# EAGLE design PROJETO+FINAL+TÉCNICAS+DE+PROTOTIPAGEM (EAGLE 9.7.0)
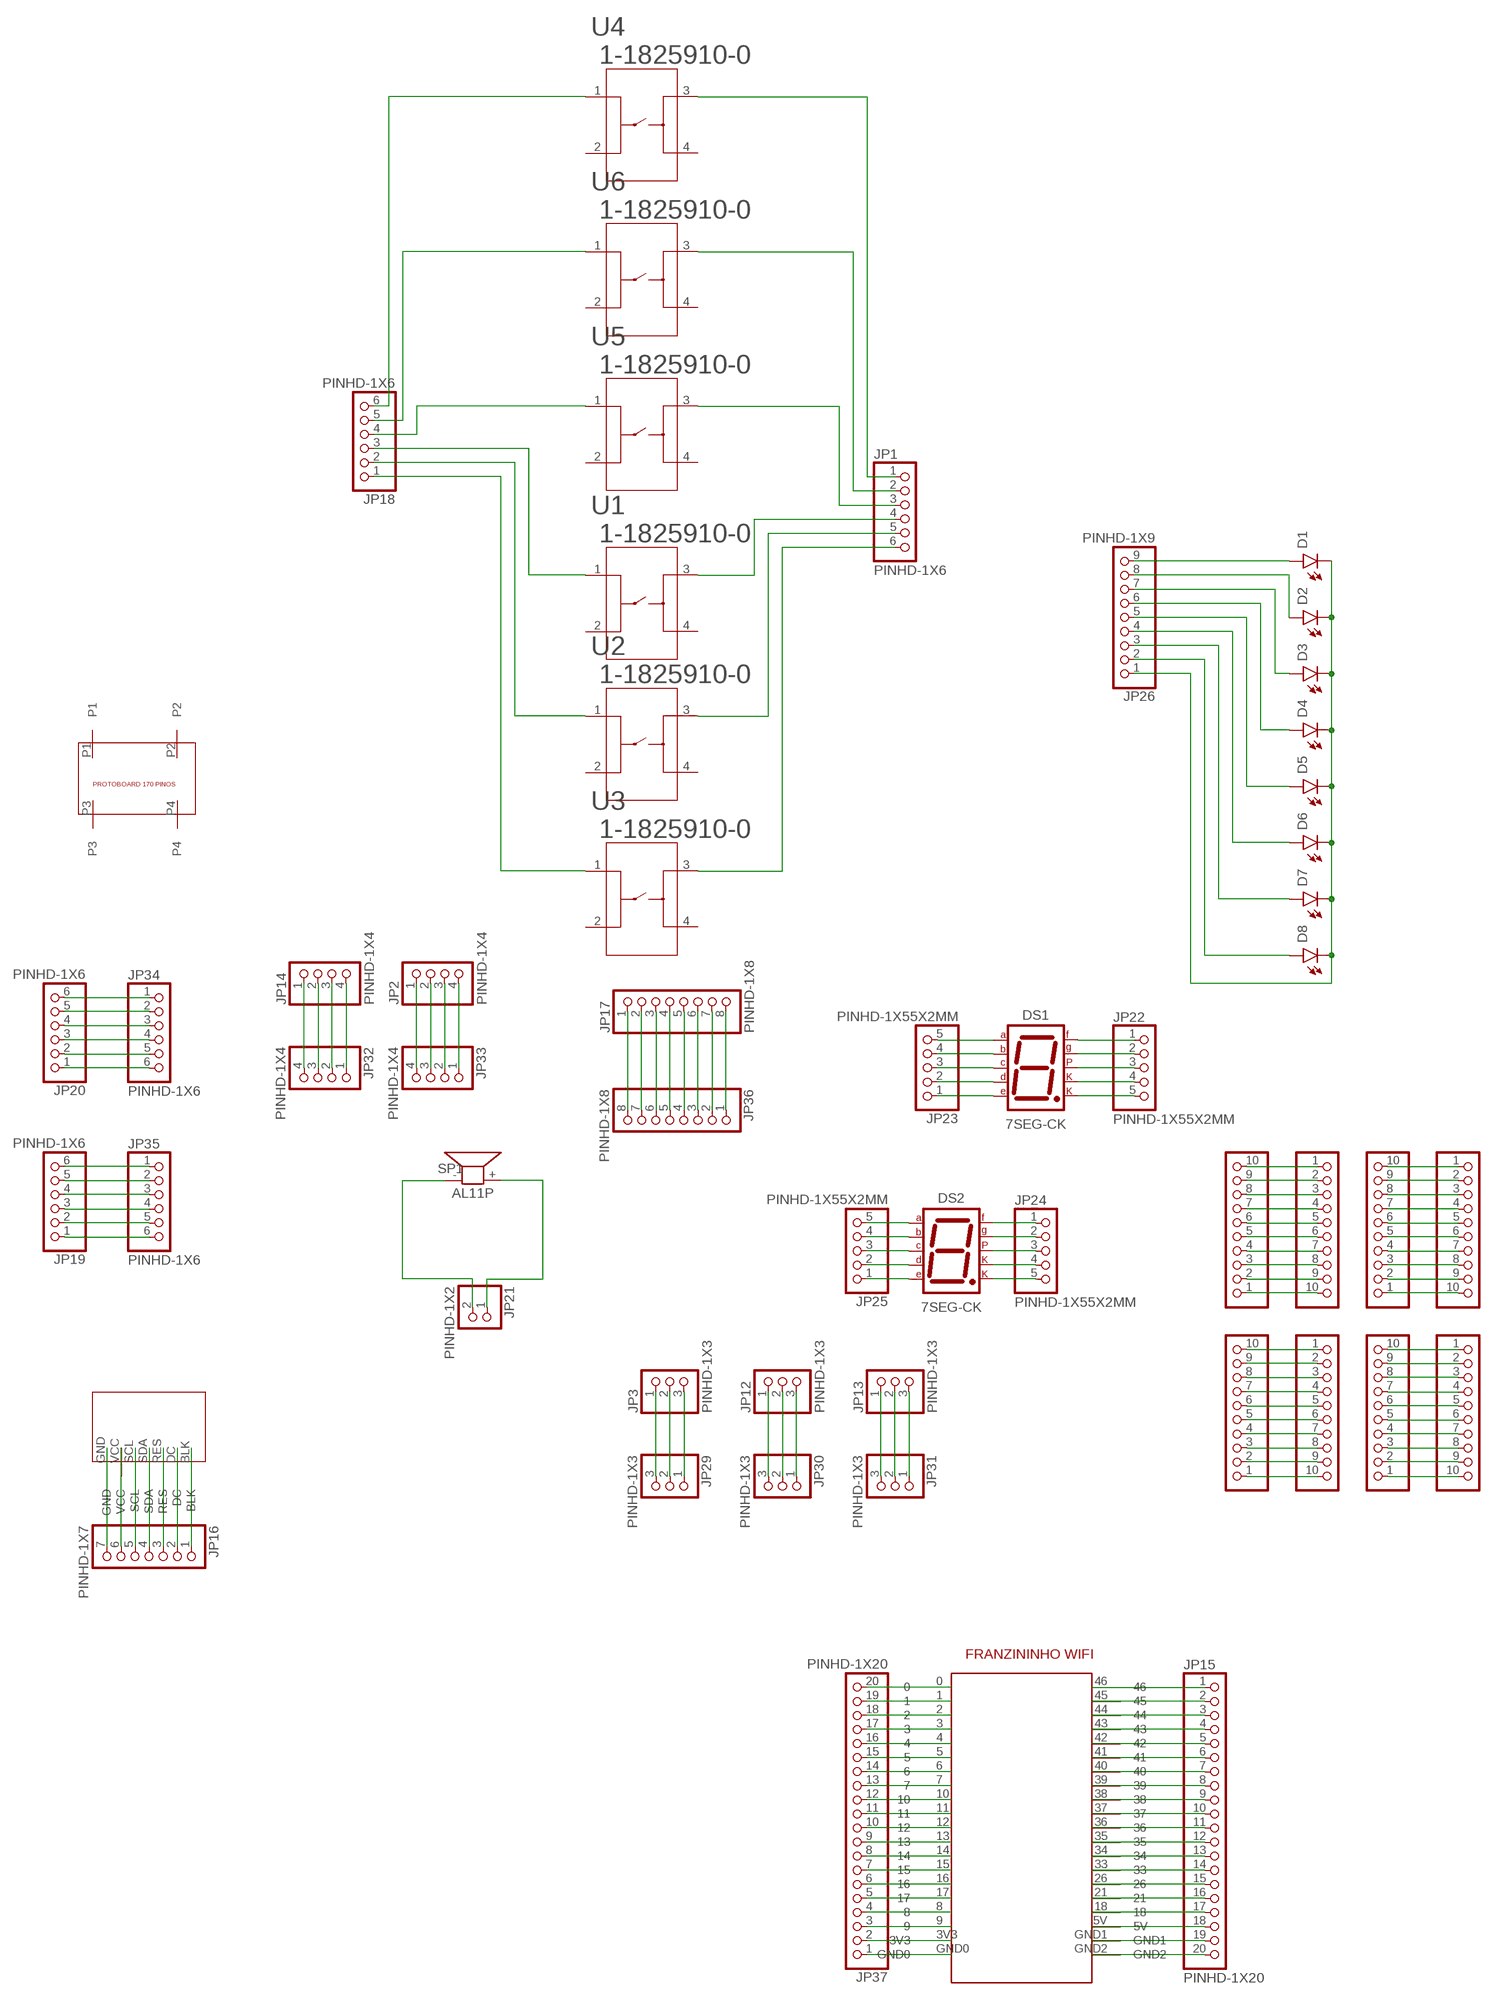
[diagram p0: schematic, sheet 1]

## Parts
D1  LED_RADIAL  [LEDRD254W60D565H860B_W_V1]
D2  LED_RADIAL  [LEDRD254W60D565H860B_W_V1]
D3  LED_RADIAL  [LEDRD254W60D565H860B_W_V1]
D4  LED_RADIAL  [LEDRD254W60D565H860B_W_V1]
D5  LED_RADIAL  [LEDRD254W60D565H860B_W_V1]
D6  LED_RADIAL  [LEDRD254W60D565H860B_W_V1]
D7  LED_RADIAL  [LEDRD254W60D565H860B_W_V1]
D8  LED_RADIAL  [LEDRD254W60D565H860B_W_V1]
DS1  7SEG-CK  [7SEG-13]
DS2  7SEG-CK  [7SEG-13]
JP1  PINHD-1X6  [1X06]
JP2  PINHD-1X4  [1X04]
JP3  PINHD-1X3  [1X03]
JP4  PINHD-1X10  [1X10]
JP5  PINHD-1X10  [1X10]
JP6  PINHD-1X10  [1X10]
JP7  PINHD-1X10  [1X10]
JP8  PINHD-1X10  [1X10]
JP9  PINHD-1X10  [1X10]
JP10  PINHD-1X10  [1X10]
JP11  PINHD-1X10  [1X10]
JP12  PINHD-1X3  [1X03]
JP13  PINHD-1X3  [1X03]
JP14  PINHD-1X4  [1X04]
JP15  PINHD-1X20  [1X20]
JP16  PINHD-1X7  [1X07]
JP17  PINHD-1X8  [1X08]
JP18  PINHD-1X6  [1X06]
JP19  PINHD-1X6  [1X06]
JP20  PINHD-1X6  [1X06]
JP21  PINHD-1X2  [1X02]
JP22  PINHD-1X55X2MM  [1_05X2MM]
JP23  PINHD-1X55X2MM  [1_05X2MM]
JP24  PINHD-1X55X2MM  [1_05X2MM]
JP25  PINHD-1X55X2MM  [1_05X2MM]
JP26  PINHD-1X9  [1X09]
JP29  PINHD-1X3  [1X03]
JP30  PINHD-1X3  [1X03]
JP31  PINHD-1X3  [1X03]
JP32  PINHD-1X4  [1X04]
JP33  PINHD-1X4  [1X04]
JP34  PINHD-1X6  [1X06]
JP35  PINHD-1X6  [1X06]
JP36  PINHD-1X8  [1X08]
JP37  PINHD-1X20  [1X20]
SP1  AL11P  [AL11P]
U1  1-1825910-0  [SWITCH_1-1825910-0]
U2  1-1825910-0  [SWITCH_1-1825910-0]
U3  1-1825910-0  [SWITCH_1-1825910-0]
U4  1-1825910-0  [SWITCH_1-1825910-0]
U5  1-1825910-0  [SWITCH_1-1825910-0]
U6  1-1825910-0  [SWITCH_1-1825910-0]
U$1  FRANZINO_WIFI  [FRANZININHO_WIFI]
U$2  DISPLAY_TFT_SPI  [PERIMETRO_DISPLAY_TFT]
U$3  PROTOBOARD_170_PINOS  [PROTOBOARD_170_PINOS]

## Nets
N$1: D1.1(A) JP26.9
N$2: D2.1(A) JP26.8
N$3: D3.1(A) JP26.7
N$4: D4.1(A) JP26.6
N$5: D5.1(A) JP26.5
N$6: D6.1(A) JP26.4
N$7: D7.1(A) JP26.3
N$8: D8.1(A) JP26.2
N$9: D1.2(C) D2.2(C) D3.2(C) D4.2(C) D5.2(C) D6.2(C) D7.2(C) D8.2(C) JP26.1
N$10: JP8.2 JP8.6 JP10.5 JP10.9
N$11: JP7.2 JP7.6 JP9.5 JP9.9
N$12: JP4.2 JP4.6 JP6.5 JP6.9
N$13: JP5.2 JP5.6 JP11.5 JP11.9
N$14: JP7.1 JP9.10
N$15: JP7.3 JP9.8
N$16: JP7.4 JP9.7
N$17: JP7.5 JP9.6
N$18: JP1.1 U4.3
N$19: JP1.2 U6.3
N$20: JP1.3 U5.3
N$21: JP1.4 U1.3
N$22: JP1.5 U2.3
N$23: JP1.6 U3.3
N$24: JP18.6 U4.1
N$25: JP18.5 U6.1
N$26: JP18.4 U5.1
N$27: JP18.3 U1.1
N$28: JP18.2 U2.1
N$29: JP18.1 U3.1
N$30: DS1.9(F) JP22.1
N$31: DS1.10(G) JP22.2
N$32: DS1.5(DP) JP22.3
N$33: DS1.3(CK1) JP22.4
N$34: DS1.8(CK2) JP22.5
N$35: DS1.7(A) JP23.5
N$36: DS1.6(B) JP23.4
N$37: DS1.4(C) JP23.3
N$38: DS1.2(D) JP23.2
N$39: DS1.1(E) JP23.1
N$40: DS2.9(F) JP24.1
N$41: DS2.10(G) JP24.2
N$42: DS2.5(DP) JP24.3
N$43: DS2.3(CK1) JP24.4
N$44: DS2.8(CK2) JP24.5
N$45: DS2.7(A) JP25.5
N$46: DS2.6(B) JP25.4
N$47: DS2.4(C) JP25.3
N$48: DS2.2(D) JP25.2
N$49: DS2.1(E) JP25.1
N$50: JP21.1 SP1.+
N$51: JP21.2 SP1.-
N$52: JP15.11 JP37.16 U$1.4 U$1.36
N$53: JP15.9 JP37.4 U$1.8 U$1.38
N$54: JP37.20 U$1.0
N$55: JP37.19 U$1.1
N$56: JP37.18 U$1.2
N$57: JP37.17 U$1.3
N$58: JP37.15 U$1.5
N$59: JP37.14 U$1.6
N$60: JP37.13 U$1.7
N$61: JP37.12 U$1.10
N$62: JP37.11 U$1.11
N$63: JP37.10 U$1.12
N$64: JP37.9 U$1.13
N$65: JP37.8 U$1.14
N$66: JP37.7 U$1.15
N$67: JP37.6 U$1.16
N$68: JP37.5 U$1.17
N$69: JP37.3 U$1.9
N$70: JP37.2 U$1.3V3
N$71: JP37.1 U$1.GND0
N$72: JP15.1 U$1.46
N$73: JP15.2 U$1.45
N$74: JP15.3 U$1.44
N$75: JP15.4 U$1.43
N$76: JP15.5 U$1.42
N$77: JP15.6 U$1.41
N$78: JP15.7 U$1.40
N$79: JP15.8 U$1.39
N$80: JP15.10 U$1.37
N$81: JP15.12 U$1.35
N$82: JP15.13 U$1.34
N$83: JP15.14 U$1.33
N$84: JP15.15 U$1.26
N$85: JP15.16 U$1.21
N$86: JP15.17 U$1.18
N$87: JP15.18 U$1.5V
N$88: JP15.19 U$1.GND1
N$89: JP15.20 U$1.GND2
N$90: JP3.1 JP29.3
N$91: JP3.2 JP29.2
N$92: JP3.3 JP29.1
N$93: JP12.1 JP30.3
N$94: JP12.2 JP30.2
N$95: JP12.3 JP30.1
N$96: JP13.1 JP31.3
N$97: JP13.2 JP31.2
N$98: JP13.3 JP31.1
N$99: JP14.1 JP32.4
N$100: JP14.2 JP32.3
N$101: JP14.3 JP32.2
N$102: JP14.4 JP32.1
N$103: JP2.1 JP33.4
N$104: JP2.2 JP33.3
N$105: JP2.3 JP33.2
N$106: JP2.4 JP33.1
N$107: JP20.6 JP34.1
N$108: JP20.5 JP34.2
N$109: JP20.4 JP34.3
N$110: JP20.3 JP34.4
N$111: JP20.2 JP34.5
N$112: JP20.1 JP34.6
N$113: JP19.6 JP35.1
N$114: JP19.5 JP35.2
N$115: JP19.4 JP35.3
N$116: JP19.3 JP35.4
N$117: JP19.2 JP35.5
N$118: JP19.1 JP35.6
N$119: JP17.1 JP36.8
N$120: JP17.2 JP36.7
N$121: JP17.3 JP36.6
N$122: JP17.4 JP36.5
N$123: JP17.5 JP36.4
N$124: JP17.6 JP36.3
N$125: JP17.7 JP36.2
N$126: JP17.8 JP36.1
N$127: JP7.7 JP9.4
N$128: JP7.8 JP9.3
N$129: JP7.9 JP9.2
N$130: JP7.10 JP9.1
N$131: JP8.1 JP10.10
N$132: JP8.3 JP10.8
N$133: JP8.4 JP10.7
N$134: JP8.5 JP10.6
N$135: JP8.7 JP10.4
N$136: JP8.8 JP10.3
N$137: JP8.9 JP10.2
N$138: JP8.10 JP10.1
N$139: JP4.1 JP6.10
N$140: JP4.3 JP6.8
N$141: JP4.4 JP6.7
N$142: JP4.5 JP6.6
N$143: JP4.7 JP6.4
N$144: JP4.8 JP6.3
N$145: JP4.9 JP6.2
N$146: JP4.10 JP6.1
N$147: JP5.1 JP11.10
N$148: JP5.3 JP11.8
N$149: JP5.4 JP11.7
N$150: JP5.5 JP11.6
N$151: JP5.7 JP11.4
N$152: JP5.8 JP11.3
N$153: JP5.9 JP11.2
N$154: JP5.10 JP11.1
N$155: JP16.7 U$2.GND
N$156: JP16.6 U$2.VCC
N$157: JP16.5 U$2.SCL
N$158: JP16.4 U$2.SDA
N$159: JP16.3 U$2.RES
N$160: JP16.2 U$2.DC
N$161: JP16.1 U$2.BLK
Unconnected: U1.2 U1.4 U2.2 U2.4 U3.2 U3.4 U4.2 U4.4 U5.2 U5.4 U6.2 U6.4 U$3.P1 U$3.P2 U$3.P3 U$3.P4

## Library data of the parts
D1-D8 = Lib_Opto_Eletronic_Led_Verde:LED_RADIAL: LED - Generic
DS1 DS2 = Opto-Electronic:7SEG-CK: 7-segment DISPLAY single cathode, 13 mm; CATEGORY: Opto-Electronic; SUB-CATEGORY: Display; TYPE: 7-Segment
JP1 JP18-JP20 JP34 JP35 = Connector:PINHD-1X6: PIN HEADER; CATEGORY: CONNECTOR; SUB-CATEGORY: PIN-HEADER
JP2 JP14 JP32 JP33 = Connector:PINHD-1X4: PIN HEADER; CATEGORY: CONNECTOR; SUB-CATEGORY: PIN-HEADER
JP3 JP12 JP13 JP29-JP31 = Connector:PINHD-1X3: PIN HEADER; CATEGORY: CONNECTOR; SUB-CATEGORY: PIN-HEADER
JP4-JP11 = Connector:PINHD-1X10: PIN HEADER; CATEGORY: CONNECTOR; SUB-CATEGORY: PIN-HEADER
JP15 JP37 = Connector:PINHD-1X20: PIN HEADER; CATEGORY: CONNECTOR; SUB-CATEGORY: PIN-HEADER
JP16 = Connector:PINHD-1X7: PIN HEADER; CATEGORY: CONNECTOR; SUB-CATEGORY: PIN-HEADER
JP17 JP36 = Connector:PINHD-1X8: PIN HEADER; CATEGORY: CONNECTOR; SUB-CATEGORY: PIN-HEADER
JP21 = Connector:PINHD-1X2: PIN HEADER; CATEGORY: CONNECTOR; SUB-CATEGORY: PIN-HEADER
JP22-JP25 = Connector:PINHD-1X5: PIN HEADER; CATEGORY: CONNECTOR; SUB-CATEGORY: PIN-HEADER
JP26 = Connector:PINHD-1X9: PIN HEADER; CATEGORY: CONNECTOR; SUB-CATEGORY: PIN-HEADER
SP1 = buzzer:AL11P: SPEAKER Source: Buerklin; OC_FARNELL: unknown; OC_NEWARK: unknown
U1-U6 = Switches:1-1825910-0; BUILT_BY: EMA_UL_Team; CATEGORY: Tactile Switches; COPYRIGHT: Copyright (C) 2016 Accelerated Designs. All rights reserved; DESCRIPTION: FSM6JH=6MM TACT SWITCH, HIGH TEMP; MANUFACTURER_PART_NUMBER: 1-1825910-0; PART_STATUS: active; SERIES: Unknown; VENDOR: TE Connectivity
U$1 = biblioteca franzininho wifi:FRANZINO_WIFI
U$2 = biblioteca display tft:DISPLAY_TFT_SPI
U$3 = biblioteca protoboard 170 pinos:PROTOBOARD_170_PINOS

## Board
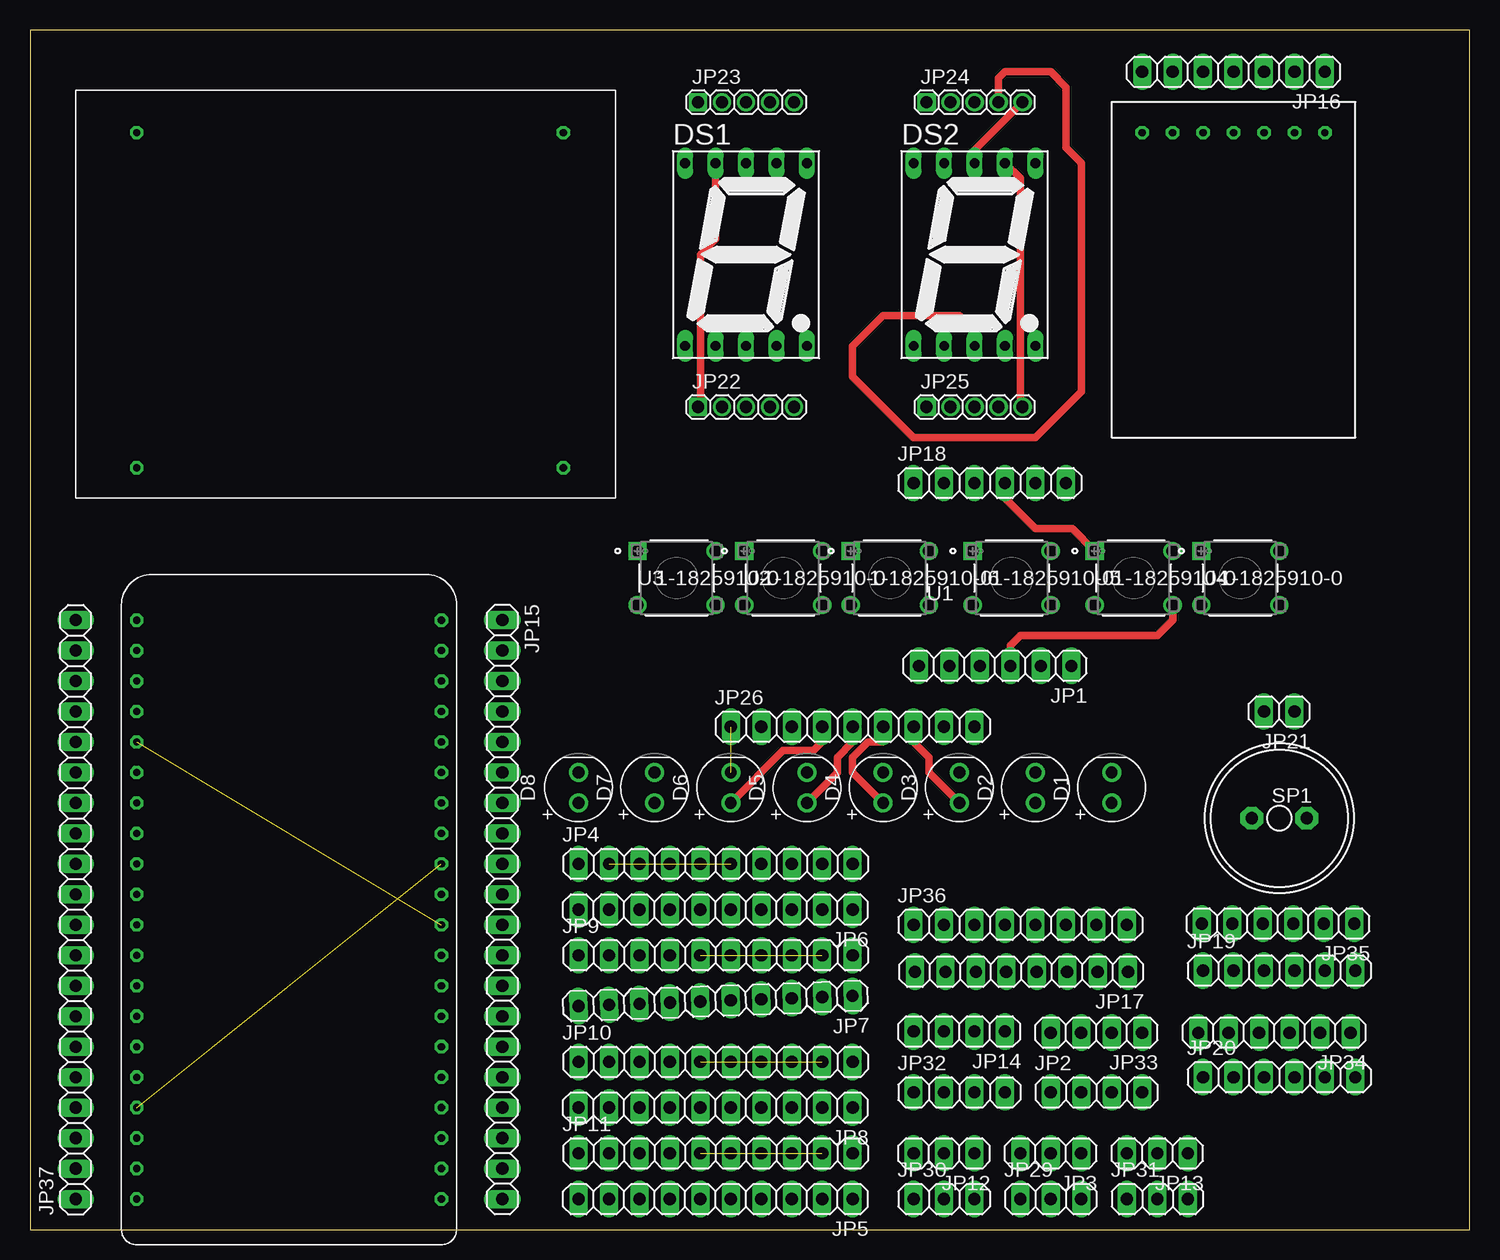
[diagram p1: board, top side]
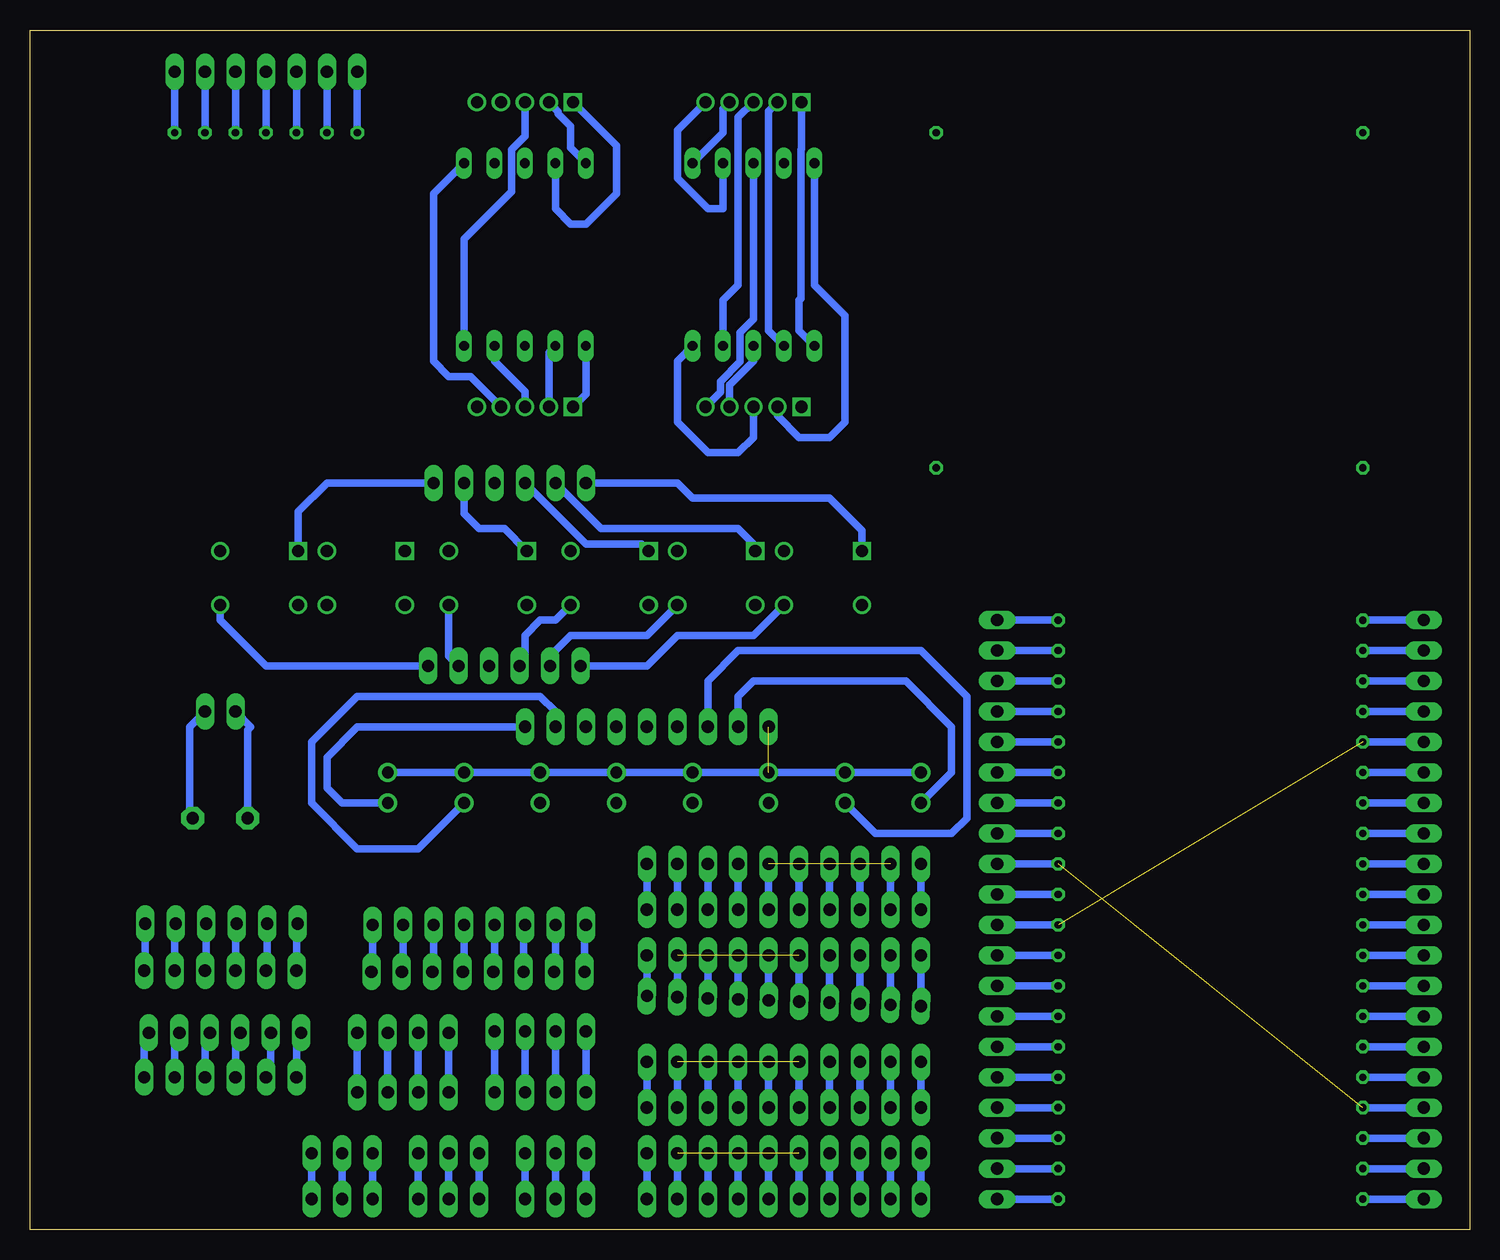
[diagram p2: board, bottom side, seen from below]

Size 120 x 100 mm. Coordinates in mm from the lower left corner, seen from the top.
Outline: 0,0 120,0 120,100 0,100 0,0
Copper layers (1*16): Top / Bottom
Stack-up Default Layer Stack: Top User Defined 0.035mm / Dielectric-1 User Defined 1.5mm / Bottom User Defined 0.035mm
Design rules "default": minimum track width 6mil, minimum drill 0.35mm, track to track 6mil, track to pad 6mil, pad to pad 6mil, via to via 6mil, smd to smd 6mil, copper to edge 40mil, drill to drill 6mil, minimum pad ring 10mil, minimum via ring 8mil, stop-mask expansion 4mil, vias tented up to drill 0mil, thermal gap 10mil

### Footprints (pad centres in the part's own frame; a part is rotated, then mirrored left to right if it is on the bottom)
LEDRD254W60D565H860B_W_V1 = drill 0.981 pad 1.581: 1 -1.27,0; 2 1.27,0
7SEG-13 = drill 0.813 long: 1 -5.08,-7.62; 2 -2.54,-7.62; 3 0,-7.62; 4 2.54,-7.62; 5 5.08,-7.62; 6 5.08,7.62; 7 2.54,7.62; 8 0,7.62; 9 -2.54,7.62; 10 -5.08,7.62
1X06 = drill 1.016 long: 1 -6.35,0; 2 -3.81,0; 3 -1.27,0; 4 1.27,0; 5 3.81,0; 6 6.35,0
1X04 = drill 1.016 long: 1 -3.81,0; 2 -1.27,0; 3 1.27,0; 4 3.81,0
1X03 = drill 1.016 long: 1 -2.54,0; 2 0,0; 3 2.54,0
1X10 = drill 1.016 long: 1 -11.43,0; 2 -8.89,0; 3 -6.35,0; 4 -3.81,0; 5 -1.27,0; 6 1.27,0; 7 3.81,0; 8 6.35,0; 9 8.89,0; 10 11.43,0
1X20 = drill 1.016 long: 1 -24.13,0; 2 -21.59,0; 3 -19.05,0; 4 -16.51,0; 5 -13.97,0; 6 -11.43,0; 7 -8.89,0; 8 -6.35,0; 9 -3.81,0; 10 -1.27,0; 11 1.27,0; 12 3.81,0; 13 6.35,0; 14 8.89,0; 15 11.43,0; 16 13.97,0; 17 16.51,0; 18 19.05,0; 19 21.59,0; 20 24.13,0
1X07 = drill 1.016 long: 1 -7.62,0; 2 -5.08,0; 3 -2.54,0; 4 0,0; 5 2.54,0; 6 5.08,0; 7 7.62,0
1X08 = drill 1.016 long: 1 -8.89,0; 2 -6.35,0; 3 -3.81,0; 4 -1.27,0; 5 1.27,0; 6 3.81,0; 7 6.35,0; 8 8.89,0
1X02 = drill 1.016 long: 1 -1.27,0; 2 1.27,0
1_05X2MM = drill 1.016 pad 1.3 square: 1 -4,0 | drill 1.016 pad 1.3: 2 -2,0; 3 0,0; 4 2,0; 5 4,0
1X09 = drill 1.016 long: 1 -10.16,0; 2 -7.62,0; 3 -5.08,0; 4 -2.54,0; 5 0,0; 6 2.54,0; 7 5.08,0; 8 7.62,0; 9 10.16,0
AL11P = drill 1.016 pad 1.905 octagon: + 2.286,0; - -2.286,0
SWITCH_1-1825910-0 = drill 1.016 pad 1.524 square: 1 -6.502,4.496 | drill 1.016 pad 1.524: 2 -6.502,0; 3 0,0; 4 0,4.496
FRANZININHO_WIFI = drill 0.6 octagon: 0 0,48.26; 1 0,45.72; 2 0,43.18; 3 0,40.64; 3V3 0,2.54; 4 0,38.1; 5 0,35.56; 5V 25.4,5.08; 6 0,33.02; 7 0,30.48; 8 0,7.62; 9 0,5.08; 10 0,27.94; 11 0,25.4; 12 0,22.86; 13 0,20.32; 14 0,17.78; 15 0,15.24; 16 0,12.7; 17 0,10.16; 18 25.4,7.62; 21 25.4,10.16; 26 25.4,12.7; 33 25.4,15.24; 34 25.4,17.78; 35 25.4,20.32; 36 25.4,22.86; 37 25.4,25.4; 38 25.4,27.94; 39 25.4,30.48; 40 25.4,33.02; 41 25.4,35.56; 42 25.4,38.1; 43 25.4,40.64; 44 25.4,43.18; 45 25.4,45.72; 46 25.4,48.26; GND0 0,0; GND1 25.4,2.54; GND2 25.4,0
PERIMETRO_DISPLAY_TFT = drill 0.6 octagon: BLK 15.24,0; DC 12.7,0; GND 0,0; RES 10.16,0; SCL 5.08,0; SDA 7.62,0; VCC 2.54,0
PROTOBOARD_170_PINOS = drill 0.6 octagon: P1 5.08,30.48; P2 5.08,2.54; P3 40.64,30.48; P4 40.64,2.54

### Placement (x,y rotation side)
D1  90.17,36.83 90 top
D2  83.82,36.83 90 top
D3  77.47,36.83 90 top
D4  71.12,36.83 90 top
D5  64.77,36.83 90 top
D6  58.42,36.83 90 top
D7  52.07,36.83 90 top
D8  45.72,36.83 90 top
DS1  59.69,81.28 0 top
DS2  78.74,81.28 0 top
JP1  80.45,46.99 180 top
JP2  88.9,11.43 0 top
JP3  85.09,6.35 180 top
JP4  57.15,30.48 0 top
JP5  57.15,2.54 180 top
JP6  57.15,26.67 180 top
JP7  57.15,19.05 182.1 top
JP8  57.15,10.16 180 top
JP9  57.15,22.86 0 top
JP10  57.15,13.97 0 top
JP11  57.15,6.35 0 top
JP12  76.2,6.35 180 top
JP13  93.98,6.35 180 top
JP14  77.47,16.51 180 top
JP15  39.37,26.67 270 top
JP16  100.33,96.52 180 top
JP17  82.65,21.49 180 top
JP18  80.01,62.23 0 top
JP19  104.14,21.59 0 top
JP20  104.14,12.7 0 top
JP21  104.14,43.18 180 top
JP22  59.69,68.58 0 top
JP23  59.69,93.98 0 top
JP24  78.74,93.98 0 top
JP25  78.74,68.58 0 top
JP26  68.58,41.91 0 top
JP29  85.09,2.54 0 top
JP30  76.2,2.54 0 top
JP31  93.98,2.54 0 top
JP32  77.47,11.43 0 top
JP33  88.9,16.41 180 top
JP34  103.73,16.41 180 top
JP35  104.04,25.5 180 top
JP36  82.55,25.4 0 top
JP37  3.81,26.67 90 top
SP1  104.14,34.29 0 top
U1  74.93,52.07 0 top
U2  66.04,52.07 0 top
U3  57.15,52.07 0 top
U4  104.14,52.07 0 top
U5  95.25,52.07 0 top
U6  85.09,52.07 0 top
U$1  8.89,2.54 0 top
U$2  92.71,91.44 0 top
U$3  3.81,60.96 0 top

### Tracks (layer width: path | path; a pad name or v marks a point on that pad's centre or on a via)
N$1
  Bottom 0.61: D1.1 93.98,35.56 95.25,36.83 95.25,39.37 92.71,41.91 JP26.9
N$2
  Bottom 0.61: D2.1 87.63,31.75 92.71,31.75 96.52,35.56 96.52,40.64 92.71,44.45 77.47,44.45 76.2,43.18 JP26.8
N$3
  Top 0.61: D3.1 74.93,38.1 74.93,39.37 73.66,40.64 JP26.7
N$4
  Top 0.61: D4.1 68.58,38.1 68.58,39.37 69.85,40.64 71.12,40.64 JP26.6
N$5
  Top 0.61: D5.1 67.31,38.1 67.31,39.37 68.58,40.64 JP26.5
N$6
  Top 0.61: D6.1 62.79,39.93 65.33,39.93 66.04,40.64 JP26.4
N$7
  Bottom 0.61: D7.1 49.53,33.02 43.18,33.02 41.91,34.29 41.91,44.45 45.72,48.26 60.96,48.26 63.5,45.72 JP26.3
N$8
  Bottom 0.61: D8.1 43.18,38.1 43.18,41.91 46.99,45.72 59.69,45.72 60.96,44.45 JP26.2
N$9  (1 unrouted)
  Bottom 0.61: D8.2 D7.2 D6.2 D5.2 D4.2 D3.2 | 78.74,38.1 D3.2 | D3.2 D2.2 D1.2
N$10  (1 unrouted)
  Bottom 0.61: JP10.5 JP8.6 | JP8.2 JP10.9
N$11  (1 unrouted)
  Bottom 0.61: JP9.5 JP7.6 | JP9.9 JP7.2
N$12  (1 unrouted)
  Bottom 0.61: JP6.9 JP4.2 | JP6.5 JP4.6
N$13  (1 unrouted)
  Bottom 0.61: JP5.6 JP11.5 | JP5.2 JP11.9
N$14
  Bottom 0.61: JP7.1 JP9.10
N$15
  Bottom 0.61: JP7.3 JP9.8
N$16
  Bottom 0.61: JP9.7 JP7.4
N$17
  Bottom 0.61: JP7.5 JP9.6
N$18
  Bottom 0.61: JP1.1 100.33,46.99 104.14,50.8 U4.3
N$19
  Bottom 0.61: JP1.2 85.09,47.82 U6.3
N$20
  Top 0.61: JP1.3 81.72,48.7 82.55,49.53 93.98,49.53 95.25,50.8 U5.3
N$21
  Bottom 0.61: JP1.4 78.74,47.43 78.74,49.53 77.47,50.8 76.2,50.8 U1.3
N$22
  Bottom 0.61: JP1.5 76.64,47.82 74.93,49.53 68.58,49.53 U2.3
N$23
  Bottom 0.61: U3.3 59.69,49.53 66.04,49.53 68.58,46.99 JP1.6
N$24
  Bottom 0.61: JP18.6 95.25,62.23 97.64,59.84 U4.1
N$25
  Bottom 0.61: U6.1 80.44,58.42 82.55,58.42 83.82,59.69 JP18.5
N$26
  Top 0.61: U5.1 86.89,58.42 83.82,58.42 81.28,60.96 JP18.4
N$27
  Bottom 0.61: JP18.3 73.66,57.15 69.01,57.15 U1.1
N$28
  Bottom 0.61: JP18.2 72.39,58.42 60.96,58.42 59.54,57 U2.1
N$29
  Bottom 0.61: U3.1 50.65,58.27 53.34,60.96 64.77,60.96 66.04,62.23 JP18.1
N$30
  Top 0.61: JP22.1 55.88,68.77 55.88,81.28 57.15,82.55 DS1.9
N$31
  Bottom 0.61: DS1.10 54.61,78.74 52.07,76.2 52.07,67.31 53.34,66.04 55.88,66.04 57.69,67.85 JP22.2
N$32
  Bottom 0.61: JP22.3 59.69,66.04 60.96,64.77 63.5,64.77 66.04,67.31 66.04,72.39 DS1.5
N$33
  Bottom 0.61: JP22.4 61.69,70.39 59.69,72.39 DS1.3
N$34
  Bottom 0.61: JP22.5 62.45,69.82 62.45,70.71 60.81,72.35 60.81,74.78 59.69,75.9 DS1.8
N$35
  Bottom 0.61: JP23.5 66.04,91.63 66.04,87.63 63.5,85.09 62.23,85.09 DS1.7
N$36
  Bottom 0.61: JP23.4 62.23,93.44 62.23,91.44 DS1.6
N$37
  Bottom 0.61: JP23.3 60.96,92.71 60.96,78.74 62.23,77.47 DS1.4
N$38
  Bottom 0.61: JP23.2 58.42,93.25 58.42,74.93 DS1.2
N$39
  Bottom 0.61: JP23.1 55.69,90.06 55.73,90.02 55.73,77.62 55.88,77.47 55.88,74.93 DS1.1
N$40
  Bottom 0.61: JP24.1 71.12,90.36 71.12,86.36 73.66,83.82 74.93,83.82 76.2,85.09 DS2.9
N$41
  Bottom 0.61: JP24.2 75.96,93.2 75.96,93.03 74.93,92 74.93,90.17 DS2.10
N$42
  Bottom 0.61: JP24.3 78.74,91.14 79.86,90.02 79.86,86.51 83.82,82.55 DS2.5
N$43
  Top 0.61: JP24.4 80.74,95.98 81.28,96.52 85.09,96.52 86.36,95.25 86.36,90.17 87.63,88.9 87.63,69.85 83.82,66.04 73.66,66.04 68.58,71.12 68.58,73.66 71.12,76.2 77.47,76.2 78.74,74.93 DS2.3
N$44
  Top 0.61: JP24.5 78.74,89.98 DS2.8
N$45
  Top 0.61: JP25.5 82.55,68.77 82.55,87.63 DS2.7
N$46
  Bottom 0.61: JP25.4 83.28,71.12 85.09,71.12 86.36,72.39 86.36,86.36 DS2.6
N$47
  Bottom 0.61: JP25.3 78.74,69.85 81.28,72.39 DS2.4
N$48
  Bottom 0.61: JP25.2 76.74,73.12 DS2.2
N$49
  Bottom 0.61: JP25.1 73.66,69.66 DS2.1
N$50
  Bottom 0.61: JP21.1 106.68,41.91 106.68,34.54 SP1.+
N$51
  Bottom 0.61: SP1.- 101.85,41.66 101.6,41.91 JP21.2
N$52  (1 unrouted)
  Bottom 0.61: JP37.16 U$1.4 | JP15.11 U$1.36
N$53  (1 unrouted)
  Bottom 0.61: JP37.4 U$1.8 | JP15.9 U$1.38
N$54
  Bottom 0.61: JP37.20 U$1.0
N$55
  Bottom 0.61: JP37.19 U$1.1
N$56
  Bottom 0.61: JP37.18 U$1.2
N$57
  Bottom 0.61: JP37.17 U$1.3
N$58
  Bottom 0.61: JP37.15 U$1.5
N$59
  Bottom 0.61: JP37.14 U$1.6
N$60
  Bottom 0.61: U$1.7 JP37.13
N$61
  Bottom 0.61: JP37.12 U$1.10
N$62
  Bottom 0.61: U$1.11 JP37.11
N$63
  Bottom 0.61: JP37.10 U$1.12
N$64
  Bottom 0.61: U$1.13 JP37.9
N$65
  Bottom 0.61: JP37.8 U$1.14
N$66
  Bottom 0.61: U$1.15 JP37.7
N$67
  Bottom 0.61: JP37.6 U$1.16
N$68
  Bottom 0.61: JP37.5 U$1.17
N$69
  Bottom 0.61: JP37.3 U$1.9
N$70
  Bottom 0.61: JP37.2 U$1.3V3
N$71
  Bottom 0.61: JP37.1 U$1.GND0
N$72
  Bottom 0.61: U$1.46 JP15.1
N$73
  Bottom 0.61: U$1.45 JP15.2
N$74
  Bottom 0.61: U$1.44 JP15.3
N$75
  Bottom 0.61: U$1.43 JP15.4
N$76
  Bottom 0.61: JP15.5 U$1.42
N$77
  Bottom 0.61: U$1.41 JP15.6
N$78
  Bottom 0.61: JP15.7 U$1.40
N$79
  Bottom 0.61: U$1.39 JP15.8
N$80
  Bottom 0.61: U$1.37 JP15.10
N$81
  Bottom 0.61: U$1.35 JP15.12
N$82
  Bottom 0.61: JP15.13 U$1.34
N$83
  Bottom 0.61: U$1.33 JP15.14
N$84
  Bottom 0.61: JP15.15 U$1.26
N$85
  Bottom 0.61: U$1.21 JP15.16
N$86
  Bottom 0.61: JP15.17 U$1.18
N$87
  Bottom 0.61: U$1.5V JP15.18
N$88
  Bottom 0.61: JP15.19 U$1.GND1
N$89
  Bottom 0.61: U$1.GND2 JP15.20
N$90
  Bottom 0.61: JP29.3 JP3.1
N$91
  Bottom 0.61: JP3.2 JP29.2
N$92
  Bottom 0.61: JP29.1 JP3.3
N$93
  Bottom 0.61: JP12.1 JP30.3
N$94
  Bottom 0.61: JP30.2 JP12.2
N$95
  Bottom 0.61: JP12.3 JP30.1
N$96
  Bottom 0.61: JP13.1 JP31.3
N$97
  Bottom 0.61: JP31.2 JP13.2
N$98
  Bottom 0.61: JP13.3 JP31.1
N$99
  Bottom 0.61: JP32.4 JP14.1
N$100
  Bottom 0.61: JP14.2 JP32.3
N$101
  Bottom 0.61: JP32.2 JP14.3
N$102
  Bottom 0.61: JP14.4 JP32.1
N$103
  Bottom 0.61: JP33.4 JP2.1
N$104
  Bottom 0.61: JP2.2 JP33.3
N$105
  Bottom 0.61: JP33.2 JP2.3
N$106
  Bottom 0.61: JP2.4 JP33.1
N$107
  Bottom 0.61: JP34.1 110.49,16 JP20.6
N$108
  Bottom 0.61: JP34.2 107.95,16 JP20.5
N$109
  Bottom 0.61: JP34.3 105.41,16 JP20.4
N$110
  Bottom 0.61: JP34.4 102.87,16 JP20.3
N$111
  Bottom 0.61: JP20.2 99.92,13.11 JP34.5
N$112
  Bottom 0.61: JP34.6 97.79,16 JP20.1
N$113
  Bottom 0.61: JP19.6 110.39,21.69 JP35.1
N$114
  Bottom 0.61: JP35.2 107.95,25.4 JP19.5
N$115
  Bottom 0.61: JP19.4 105.31,21.69 JP35.3
N$116
  Bottom 0.61: JP35.4 102.87,25.4 JP19.3
N$117
  Bottom 0.61: JP19.2 100.23,21.69 JP35.5
N$118
  Bottom 0.61: JP35.6 97.79,25.4 JP19.1
N$119
  Bottom 0.61: JP17.1 91.44,21.59 JP36.8
N$120
  Bottom 0.61: JP36.7 88.9,21.59 JP17.2
N$121
  Bottom 0.61: JP17.3 86.36,21.59 JP36.6
N$122
  Bottom 0.61: JP36.5 83.82,21.59 JP17.4
N$123
  Bottom 0.61: JP17.5 81.28,21.59 JP36.4
N$124
  Bottom 0.61: JP36.3 78.84,25.3 JP17.6
N$125
  Bottom 0.61: JP17.7 76.2,21.59 JP36.2
N$126
  Bottom 0.61: JP36.1 73.76,25.3 JP17.8
N$127
  Bottom 0.61: JP9.4 JP7.7
N$128
  Bottom 0.61: JP7.8 JP9.3
N$129
  Bottom 0.61: JP9.2 JP7.9
N$130
  Bottom 0.61: JP9.1 JP7.10
N$131
  Bottom 0.61: JP10.10 JP8.1
N$132
  Bottom 0.61: JP10.8 JP8.3
N$133
  Bottom 0.61: JP8.4 JP10.7
N$134
  Bottom 0.61: JP10.6 JP8.5
N$135
  Bottom 0.61: JP8.7 JP10.4
N$136
  Bottom 0.61: JP10.3 JP8.8
N$137
  Bottom 0.61: JP8.9 JP10.2
N$138
  Bottom 0.61: JP10.1 JP8.10
N$139
  Bottom 0.61: JP4.1 JP6.10
N$140
  Bottom 0.61: JP4.3 JP6.8
N$141
  Bottom 0.61: JP6.7 JP4.4
N$142
  Bottom 0.61: JP4.5 JP6.6
N$143
  Bottom 0.61: JP4.7 JP6.4
N$144
  Bottom 0.61: JP4.8 JP6.3
N$145
  Bottom 0.61: JP6.2 JP4.9
N$146
  Bottom 0.61: JP4.10 JP6.1
N$147
  Bottom 0.61: JP11.10 JP5.1
N$148
  Bottom 0.61: JP11.8 JP5.3
N$149
  Bottom 0.61: JP5.4 JP11.7
N$150
  Bottom 0.61: JP11.6 JP5.5
N$151
  Bottom 0.61: JP11.4 JP5.7
N$152
  Bottom 0.61: JP11.3 JP5.8
N$153
  Bottom 0.61: JP5.9 JP11.2
N$154
  Bottom 0.61: JP11.1 JP5.10
N$155
  Bottom 0.61: JP16.7 U$2.GND
N$156
  Bottom 0.61: JP16.6 U$2.VCC
N$157
  Bottom 0.61: U$2.SCL JP16.5
N$158
  Bottom 0.61: JP16.4 U$2.SDA
N$159
  Bottom 0.61: JP16.3 U$2.RES
N$160
  Bottom 0.61: JP16.2 U$2.DC
N$161
  Bottom 0.61: JP16.1 U$2.BLK